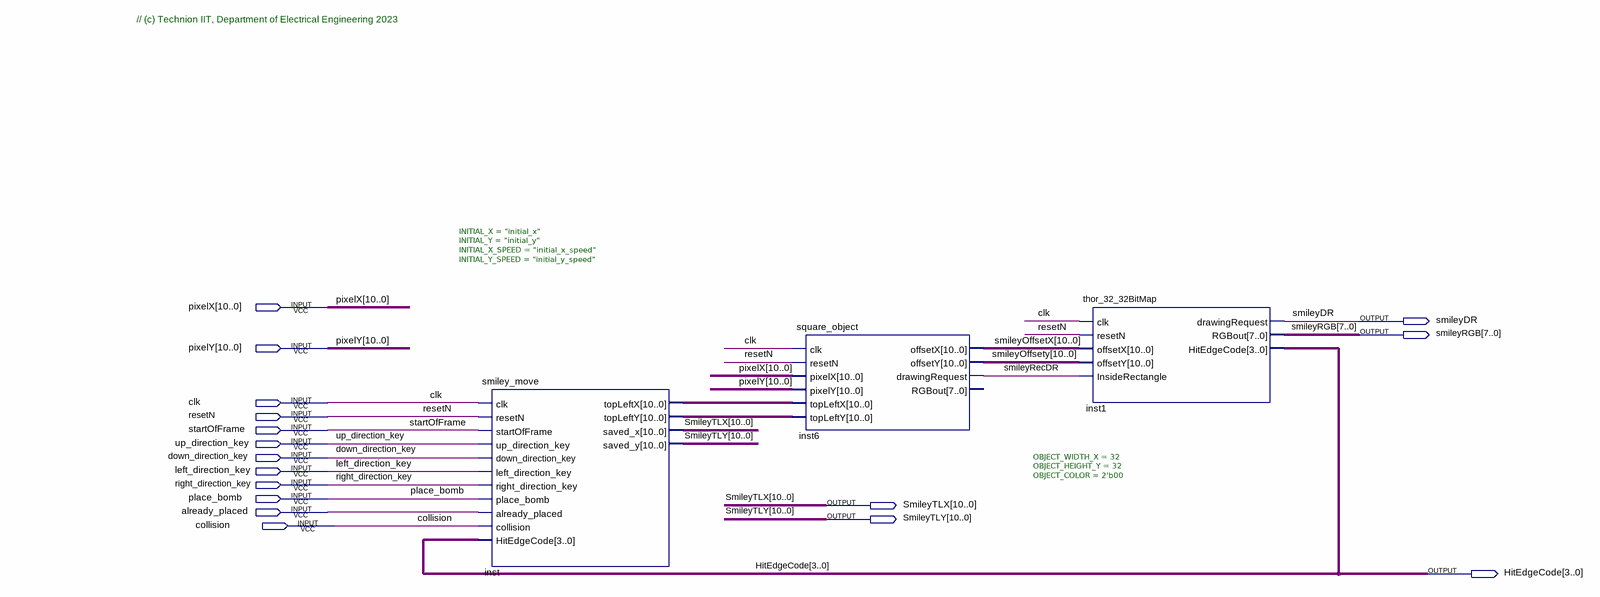
[diagram p0: schematic sheet]
// Quartus schematic Thor_Block_T.bdf as structural Verilog: 3 symbols, 17 pins
module Thor_Block_T (
  input  [10:0] pixelX,
  input  [10:0] pixelY,
  input  clk,
  input  resetN,
  input  startOfFrame,
  input  up_direction_key,
  input  down_direction_key,
  input  left_direction_key,
  input  right_direction_key,
  input  place_bomb,
  input  already_placed,
  input  collision,
  output smileyDR,
  output [7:0] smileyRGB,
  output [10:0] SmileyTLX,
  output [10:0] SmileyTLY,
  output [3:0] HitEdgeCode
);

  wire smileyRecDR;
  wire [10:0] inst_topleftx, inst_toplefty, smileyOffsetX, smileyOffsety;

  smiley_move #(.INITIAL_X("initial_x"), .INITIAL_Y("initial_y"), .INITIAL_X_SPEED("initial_x_speed"), .INITIAL_Y_SPEED("initial_y_speed")) inst (
    .clk(clk), .resetN(resetN), .startOfFrame(startOfFrame), .up_direction_key(up_direction_key),
    .down_direction_key(down_direction_key), .left_direction_key(left_direction_key),
    .right_direction_key(right_direction_key), .place_bomb(place_bomb), .already_placed(already_placed),
    .collision(collision), .HitEdgeCode(HitEdgeCode), .topLeftX(inst_topleftx), .topLeftY(inst_toplefty),
    .saved_x(SmileyTLX), .saved_y(SmileyTLY));
  square_object #(.OBJECT_WIDTH_X(32), .OBJECT_HEIGHT_Y(32), .OBJECT_COLOR(2'b00)) inst6 (
    .clk(clk), .resetN(resetN), .pixelX(pixelX), .pixelY(pixelY), .topLeftX(inst_topleftx),
    .topLeftY(inst_toplefty), .offsetX(smileyOffsetX), .offsetY(smileyOffsety), .drawingRequest(smileyRecDR));  // open: RGBout
  thor_32_32BitMap inst1 (
    .clk(clk), .resetN(resetN), .offsetX(smileyOffsetX), .offsetY(smileyOffsety),
    .InsideRectangle(smileyRecDR), .drawingRequest(smileyDR), .RGBout(smileyRGB), .HitEdgeCode(HitEdgeCode));

  // Notes on the sheet:
  //   // (c) Technion IIT, Department of Electrical Engineering 2023
endmodule
